# EasyEDA Pro project ZHAO-Watch-music版_2025-03-24.epro

# Schematic Schematic1
Create Date: 2025-02-28; Page Name: P1; Project Name: ZHAO-Watch-music版; Schematic Name: Schematic1; Update Date: 2025-03-11; Company: 嘉立创EDA; Page Size: A4; Version: V1.0
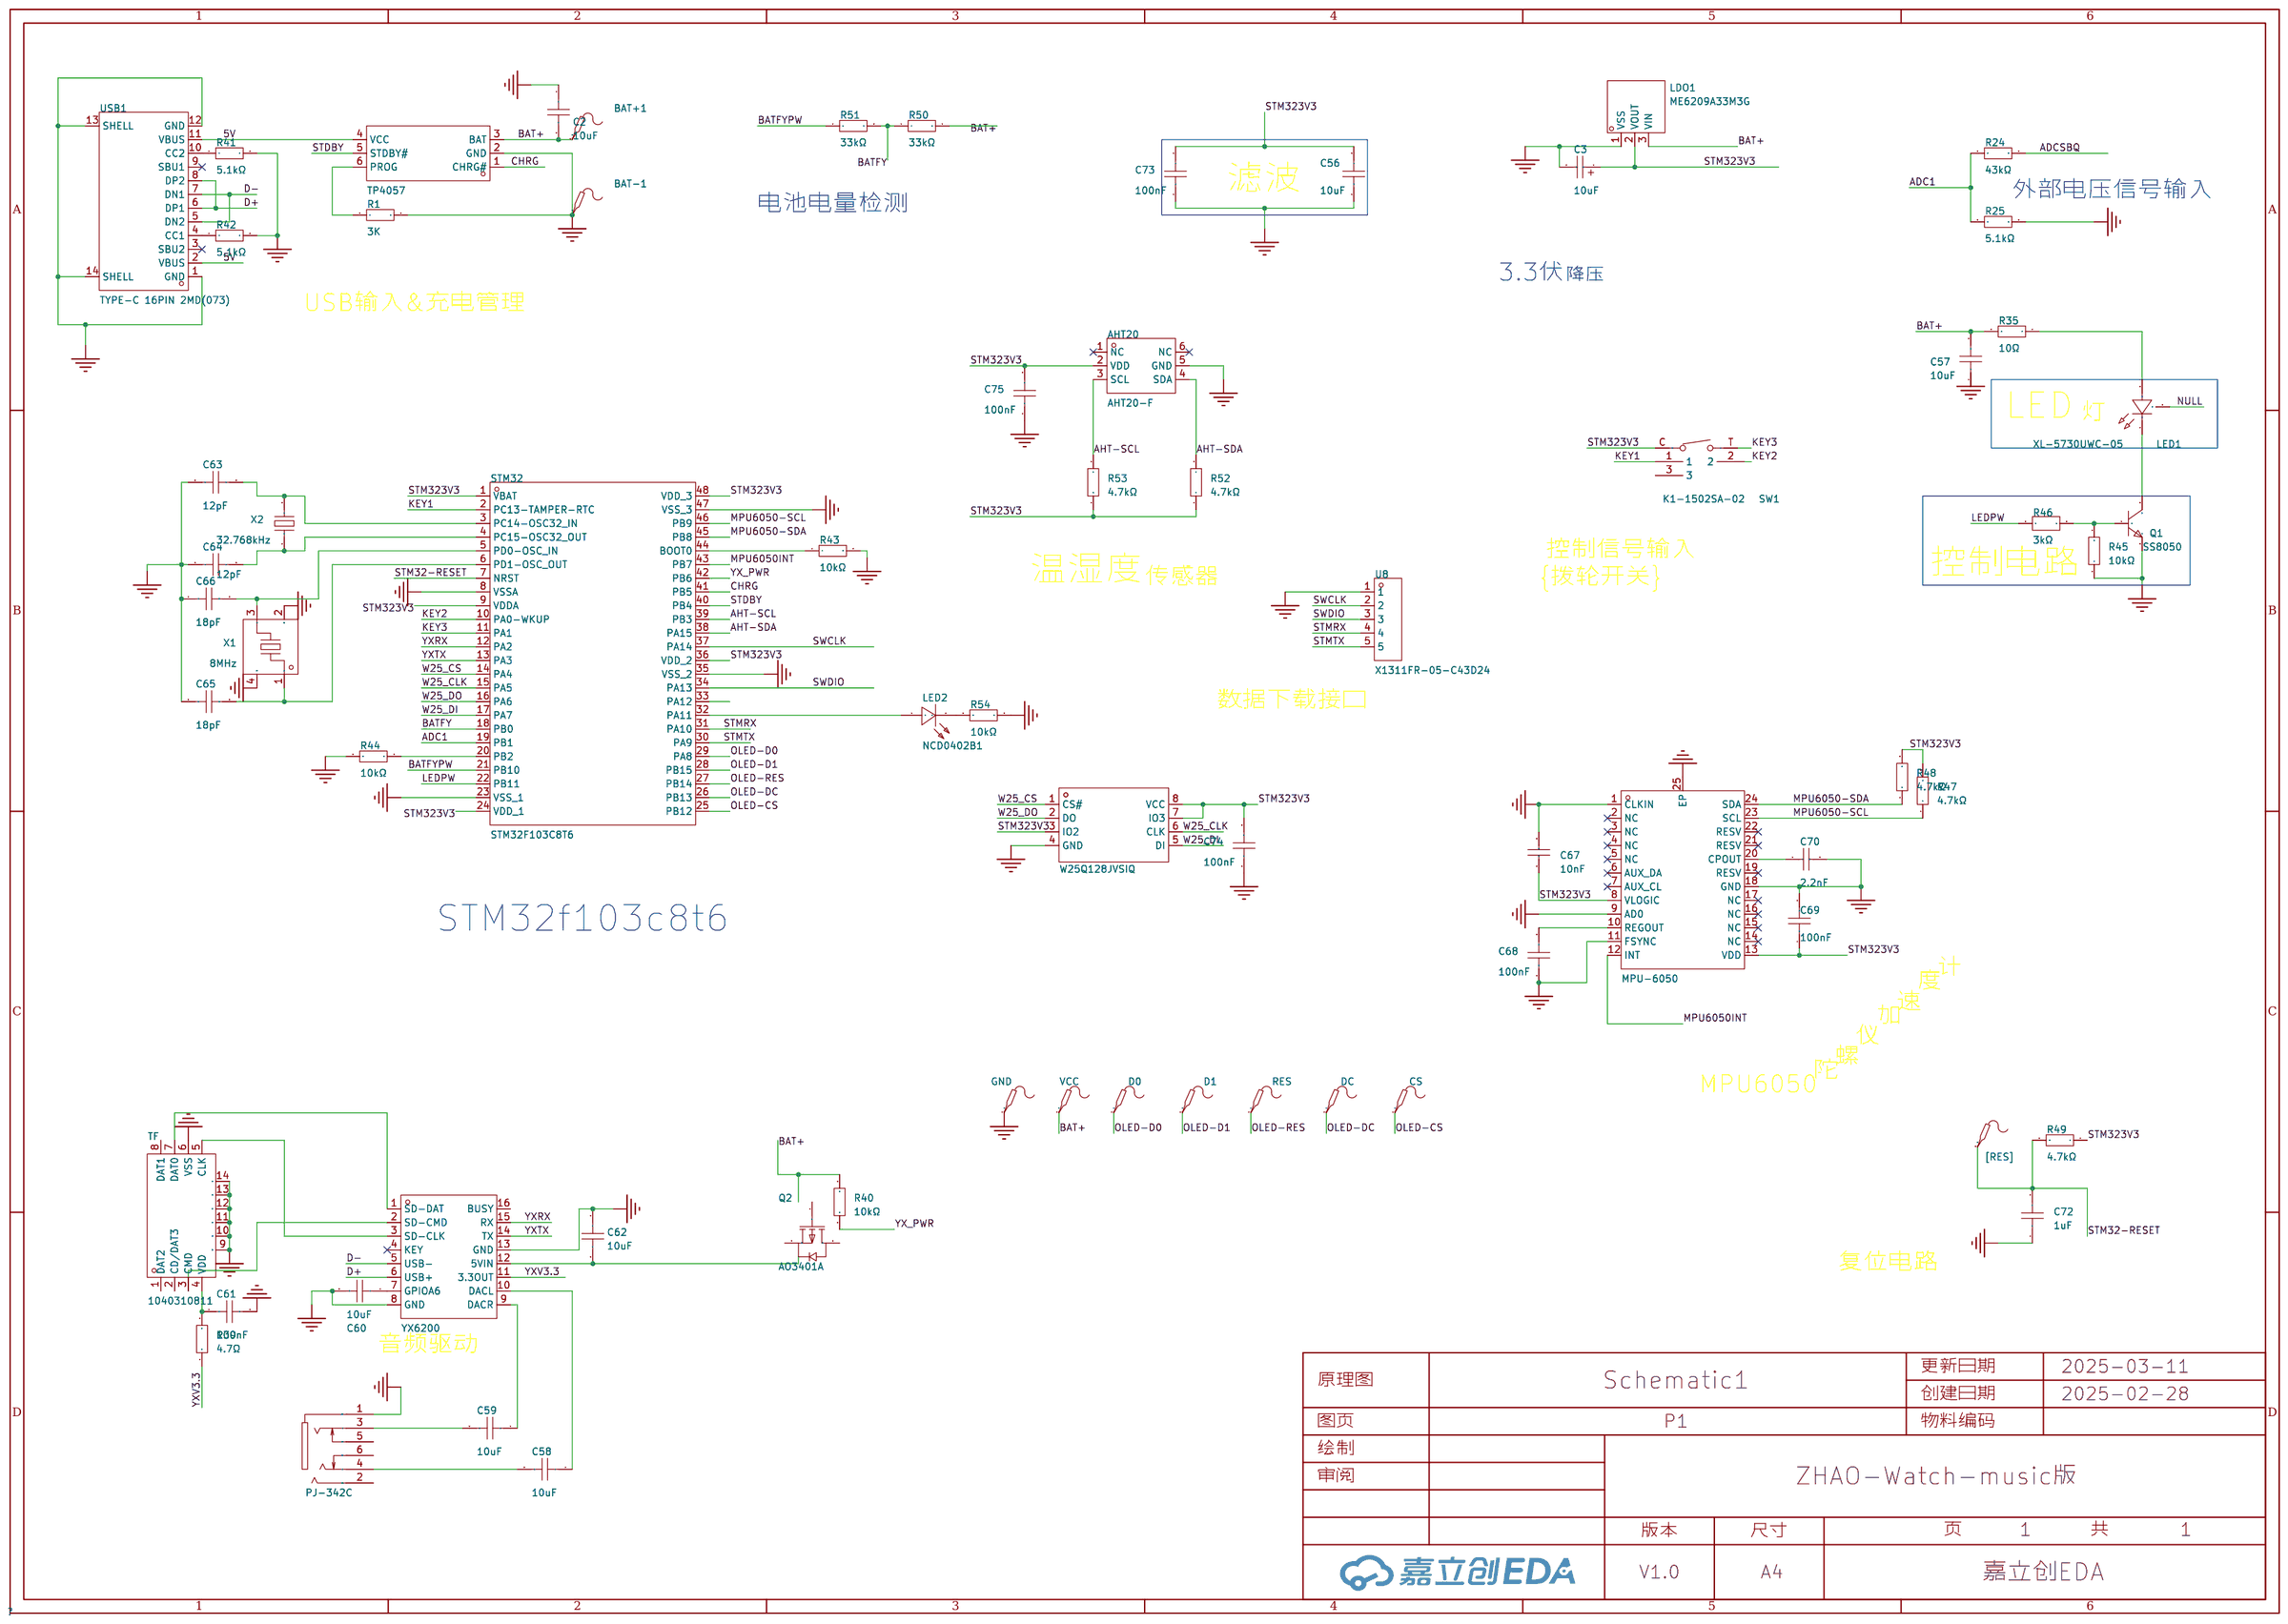
[diagram p0: schematic sheet]

## Parts
4057  TP4057  [SOT-23-6_L2.9-W1.6-P0.95-LS2.8-BR]
[RES]  -  [Test-Point-0.5mm]
AHT20  AHT20-F  [SENSOR-SMD-6_AHT20]
BAT+1  -  [Test-Point-0.5mm]
BAT-1  -  [Test-Point-0.5mm]
C2  10uF  [C0603]
C3  10uF  [CASE-A_3216]
C56  10uF  [C0603]
C57  10uF  [C0603]
C58  10uF  [C0603]
C59  10uF  [C0603]
C60  10uF  [C0603]
C61  100nF  [C0402]
C62  10uF  [C0603]
C63  12pF  [C0402]
C64  12pF  [C0402]
C65  18pF  [C0402]
C66  18pF  [C0402]
C67  10nF  [C0402]
C68  100nF  [C0402]
C69  100nF  [C0402]
C70  2.2nF  [C0402]
C72  1uF  [C0402]
C73  100nF  [C0402]
C74  100nF  [C0402]
C75  100nF  [C0402]
CN1  PJ-342C  [AUDIO-SMD_PJ-342C]
CS  -  [Test-Point-0.5mm]
D0  -  [Test-Point-0.5mm]
D1  -  [Test-Point-0.5mm]
DC  -  [Test-Point-0.5mm]
GND  -  [Test-Point-0.5mm]
LDO1  ME6209A33M3G  [SOT-23-3_L2.9-W1.6-P1.90-LS2.8-BR]
LED1  XL-5730UWC-05  [LED-SMD_3P-L5.7-W3.0-RD]
LED2  NCD0402B1  [LED0402-R-RD]
MPU-6050  MPU-6050  [QFN-24_L4.0-W4.0-P0.50-BL-EP2.7]
Q1  SS8050  [SOT-23-3_L2.9-W1.3-P1.90-LS2.4-BR]
Q2  AO3401A  [SOT-23_L2.9-W1.3-P1.90-LS2.4-BR]
R1  3K  [R0603]
R24  43kΩ  [R0603]
R25  5.1kΩ  [R0603]
R35  10Ω  [R0603]
R39  4.7Ω  [R0402]
R40  10kΩ  [R0402]
R41  5.1kΩ  [R0402]
R42  5.1kΩ  [R0402]
R43  10kΩ  [R0402]
R44  10kΩ  [R0402]
R45  10kΩ  [R0402]
R46  3kΩ  [R0402]
R47  4.7kΩ  [R0402]
R48  4.7kΩ  [R0402]
R49  4.7kΩ  [R0402]
R50  33kΩ  [R0402]
R51  33kΩ  [R0402]
R52  4.7kΩ  [R0402]
R53  4.7kΩ  [R0402]
R54  10kΩ  [R0402]
RES  -  [Test-Point-0.5mm]
STM32  STM32F103C8T6  [LQFP-48_L7.0-W7.0-P0.50-LS9.0-BL]
SW1  K1-1502SA-02  [KEY-SMD_K1-1502SA-02]
TF  1040310811  [SIM-SMD_8P-1040310811]
U8  X1311FR-05-C43D24  [CONN-TH_5P-P1.27-H-F-W4.5-N]
USB1  TYPE-C 16PIN 2MD(073)  [USB-C-SMD_TYPE-C-6PIN-2MD-073]
VCC  -  [Test-Point-0.5mm]
W25Q128  W25Q128JVSIQ  [SOIC-8_L5.3-W5.3-P1.27-LS8.0-BL]
X1  8MHz  [CRYSTAL-SMD_4P-L3.2-W2.5-BL]
X2  32.768kHz  [OSC-SMD_L3.2-W1.5]
YX6200  YX6200  [SOP-16_L9.9-W3.9-P1.27-LS6.0-BL]

## Library data of the parts
4057 = TP4057: 电源电压:6.5V;最大充电电流:500mA;电池类型:锂离子/聚合物;电池节数:1;; Supplier Part: C725791; Manufacturer: UMW(友台半导体); Supplier Footprint: SOT-23-6; JLCPCB Part Class: 扩展库; Datasheet: https://atta.szlcsc.com/upload/public/pdf/source/20231109/7FB39B0490CD1514A6792371FCA0BB30.pdf; Supplier: LCSC; Supply Voltage: 6.5V; Maximum Charge Current: 500mA; Type of Battery: 锂离子/聚合物; Number of Cells: 1; Operating Temperature: -40℃~+85℃
[RES] BAT+1 BAT-1 CS D0 D1 DC GND RES VCC = Test-Point: Test Point 测试点
AHT20 = AHT20-F: LCSC Part Name: 温湿度传感器; Supplier Part: C3012622; Manufacturer: 广州奥松; Supplier Footprint: SMD-6P,3x3mm; JLCPCB Part Class: 扩展库; Datasheet: https://atta.szlcsc.com/upload/public/pdf/source/20220512/0D1202ED7D1FEF1E65C45BAEA3A262F3.pdf; Supplier: LCSC
C2 = CL10A106MQ8NNNC: 容值:10uF;精度:±20%;额定电压:6.3V;材质(温度系数):X5R;; LCSC Part Name: 10uF ±20% 6.3V; Supplier Part: C1691; Manufacturer: SAMSUNG(三星); Supplier Footprint: 0603; JLCPCB Part Class: 扩展库; Datasheet: https://atta.szlcsc.com/upload/public/pdf/source/20160218/1457707763339.pdf; Supplier: LCSC; Tolerance: ±20%; Voltage Rated: 6.3V; Temperature Coefficient: X5R
C3 = TAJA106K010RNJ: 容值:10uF;精度:±10%;额定电压:10V;等效串联电阻:3Ω@100kHz;; LCSC Part Name: 10uF ±10% 10V; Supplier Part: C7177; Manufacturer: Kyocera AVX; Supplier Footprint: CASE-A-3216; JLCPCB Part Class: 扩展库; Datasheet: https://atta.szlcsc.com/upload/public/pdf/source/20160107/1457707750344.pdf; Supplier: LCSC; Tolerance: ±10%; Rated Voltage: 10V; Equivalent Series Resistance(ESR): 3Ω@100kHz; Operating Temperature: -55℃~+125℃
C56-C60 C62 = CAP_0603: Supplier Footprint: 0603
C61 C68 C69 C73-C75 = GRM155R71H104KE14D: 容值:100nF;精度:±10%;额定电压:50V;材质(温度系数):X7R;; LCSC Part Name: 100nF ±10% 50V; Supplier Part: C77020; Manufacturer: muRata(村田); Supplier Footprint: 0402; JLCPCB Part Class: 扩展库; Datasheet: https://atta.szlcsc.com/upload/public/pdf/source/20180326/C77020_39BD49C951FF1AF0DB1F1FAC5AC1E401.pdf; Supplier: LCSC; Tolerance: ±10%; Voltage Rated: 50V; Temperature Coefficient: X7R
C63 C64 = GCM1555C1H120FA16D: 容值:12pF;精度:±1%;额定电压:50V;材质(温度系数):C0G;; LCSC Part Name: 12pF ±1% 50V; Supplier Part: C393682; Manufacturer: muRata(村田); Supplier Footprint: 0402; JLCPCB Part Class: 扩展库; Datasheet: https://atta.szlcsc.com/upload/public/pdf/source/20190516/C393682_2405B7553F1D74F0F214F12B2CF6E34B.pdf; Supplier: LCSC; Tolerance: ±1%; Voltage Rated: 50V; Temperature Coefficient: C0G
C65 C66 = GRM1555C1H180JA01D: 容值:18pF;精度:±5%;额定电压:50V;材质(温度系数):C0G;; LCSC Part Name: 18pF ±5% 50V; Supplier Part: C33149; Manufacturer: muRata(村田); Supplier Footprint: 0402; JLCPCB Part Class: 扩展库; Datasheet: https://atta.szlcsc.com/upload/public/pdf/source/20161108/1478586362936.pdf; Supplier: LCSC; Tolerance: ±5%; Voltage Rated: 50V; Temperature Coefficient: C0G
C67 = CC0402KRX7R9BB103: 容值:10nF;精度:±10%;额定电压:50V;材质(温度系数):X7R;; LCSC Part Name: 10nF ±10% 50V; Supplier Part: C60133; Manufacturer: YAGEO(国巨); Supplier Footprint: 0402; JLCPCB Part Class: 扩展库; Datasheet: https://atta.szlcsc.com/upload/public/pdf/source/20180224/C181747_15194369449651363981.pdf; Supplier: LCSC; Tolerance: ±10%; Voltage Rated: 50V; Temperature Coefficient: X7R
C70 = GCM155R71H222KA37D: 容值:2.2nF;精度:±10%;额定电压:50V;材质(温度系数):X7R;; LCSC Part Name: 2.2nF ±10% 50V; Supplier Part: C126534; Manufacturer: muRata(村田); Supplier Footprint: 0402; JLCPCB Part Class: 扩展库; Datasheet: https://atta.szlcsc.com/upload/public/pdf/source/20170912/C126534_1505207904789963631.pdf; Supplier: LCSC; Tolerance: ±10%; Voltage Rated: 50V; Temperature Coefficient: X7R
C72 = CL05A105KA5NQNC: 容值:1uF;精度:±10%;额定电压:25V;材质(温度系数):X5R;; LCSC Part Name: 1uF ±10% 25V; Supplier Part: C52923; Manufacturer: SAMSUNG(三星); Supplier Footprint: 0402; JLCPCB Part Class: 基础库; Datasheet: https://atta.szlcsc.com/upload/public/pdf/source/20160218/1457707763339.pdf; Supplier: LCSC; Tolerance: ±10%; Voltage Rated: 25V; Temperature Coefficient: X5R
CN1 = PJ-342C_C2837091: 连接器类型:3.5mm耳机座;额定电流:1A;额定电压:20V;触头材质:磷铜;触头镀层:金;工作温度范围:-20℃~+70℃;; LCSC Part Name: 3.5mm耳机座; Supplier Part: C2837091; Manufacturer: G-Switch(品赞); Supplier Footprint: SMD; JLCPCB Part Class: 扩展库; Datasheet: https://atta.szlcsc.com/upload/public/pdf/source/20210607/C2837091_86A1520FDAE2EB54456CB4C4293AF32B.pdf; Supplier: LCSC; Connector Type: 3.5mm耳机座; Current Rating (Max): 1A; Voltage Rating (Max): 20V; Contact Material: 磷铜; Contact Plating: 金; Operating Temperature Range: -20℃~+70℃
LDO1 = ME6209A33M3G: 输出类型:固定;最大输入电压:18V;输出电压:3.3V;最大输出电流:250mA;电源纹波抑制比(PSRR):-;输出极性:正极;; LCSC Part Name: 输入18V 输出3.3V 250mA; Supplier Part: C83508; Manufacturer: MICRONE(南京微盟); Supplier Footprint: SOT-23-3L; JLCPCB Part Class: 扩展库; Datasheet: https://atta.szlcsc.com/upload/public/pdf/source/20161212/1481539101152.pdf; Supplier: LCSC; Output Type: 固定; Maximum Input Voltage: 18V; Output Voltage: 3.3V; MAX Output Current: 250mA; Dropout Voltage: 80mV@(40mA); Output Polarity: 正极; Number of Outputs: 1
LED1 = XL-5730UWC-05: 发光颜色:白色;功率:500mW;正向电流:150mA;透镜颜色:黄色透镜;色温:6000K~6500K;发光角度:120°;载带方式:正贴;工作温度:-30℃~+85℃;; Supplier Part: C2843887; Manufacturer: XINGLIGHT(成兴光); Supplier Footprint: SMD5730; JLCPCB Part Class: 扩展库; Datasheet: https://atta.szlcsc.com/upload/public/pdf/source/20221102/E8767F8417912EAAA1891B3E1CB1CE9F.pdf; Supplier: LCSC; Emitted Color: 白色; Power Dissipation: 500mW; Forward Current: 150mA; Lens Color: 黄色透镜; Color Temperature: 6000K~6500K; Viewing Angle: 120°; Mounting Sytle: 正贴; Operating Temperature: -30℃~+85℃
LED2 = NCD0402B1: 发光颜色:蓝色;正向电压(VF):2.6V~3.6V;功率:72mW;正向电流:5mA;主波长:463nm~475nm;透镜颜色:无色透明透镜;发光强度:16mcd~45mcd;发光角度:130°;工作温度:-30℃~+85℃;; Supplier Part: C130724; Manufacturer: 国星光电; Supplier Footprint: 0402; JLCPCB Part Class: 扩展库; Datasheet: https://atta.szlcsc.com/upload/public/pdf/source/20200820/C130724_4F54C0E9D8DAD44D7011DC9EC6DBEF20.pdf; Supplier: LCSC; Emitted Color: 蓝色; Forward Voltage (VF): 2.6V~3.6V; Power Dissipation: 72mW; Forward Current: 5mA; Dominant Wavelength: 463nm~475nm; Lens Color: 无色透明透镜; Luminous Intensity: 16mcd~45mcd; Viewing Angle: 130°; Operating Temperature: -30℃~+85℃
MPU-6050 = MPU-6050: 传感器类型:加速度计陀螺仪;; Supplier Part: C24112; Manufacturer: TDK InvenSense(应美盛); Supplier Footprint: QFN-24-EP(4x4); JLCPCB Part Class: 扩展库; Datasheet: https://atta.szlcsc.com/upload/public/pdf/source/20140425/1457707046159.pdf; Supplier: LCSC; Sensor Type: 加速度计陀螺仪; Operating Temperature: -40℃~+85℃
Q1 = SS8050_C7420370: 晶体管类型:NPN;集电极电流(Ic):1.5A;集射极击穿电压(Vceo):25V;功率(Pd):300mW;直流电流增益(hFE@Ic,Vce):120@100mA,1.0V;; LCSC Part Name: 耐压:25V 电流:1.5A NPN H档 200-350; Supplier Part: C7420370; Manufacturer: 宏迦橙; Supplier Footprint: SOT-23; JLCPCB Part Class: 扩展库; Datasheet: https://atta.szlcsc.com/upload/public/pdf/source/20231222/9C4050A7669EB24B3ACD0418218817FD.pdf; Supplier: LCSC; Transistor Type: NPN; Collector Current (Ic): 1.5A; Collector-Emitter Breakdown Voltage (Vceo): 25V; Power Dissipation (Pd): 300mW; DC Current Gain (hFE@Ic,Vce): 120@100mA,1.0V; Transition Frequency (fT): 100MHz; Collector Cut-Off Current (Icbo): 100nA; Collector-Emitter Saturation Voltage (VCE(sat)@Ic,Ib): 500mV@800mA,80mA; Operating Temperature: -55℃~+150℃
Q2 = AO3401A_C15127: 类型:1个P沟道;漏源电压(Vdss):30V;连续漏极电流(Id):4A;导通电阻(RDS(on)@Vgs,Id):44mΩ@10V,4.3A;功率(Pd):1.4W;阈值电压(Vgs(th)@Id):1.3V@250uA;; LCSC Part Name: 1个P沟道 耐压:30V 电流:4A; Supplier Part: C15127; Manufacturer: AOS; Supplier Footprint: SOT-23; JLCPCB Part Class: 基础库; Datasheet: https://atta.szlcsc.com/upload/public/pdf/source/20160507/1462613609053.pdf; Supplier: LCSC; Type: 1个P沟道; Drain Source Voltage (Vdss): 30V; Continuous Drain Current (Id): 4A; Drain Source On Resistance (RDS(on)@Vgs,Id): 44mΩ@10V,4.3A; Power Dissipation (Pd): 1.4W; Gate Threshold Voltage (Vgs(th)@Id): 1.3V@250uA; Total Gate Charge (Qg@Vgs): 12.2nC@4.5V; Input Capacitance (Ciss@Vds): 1.2nF@15V; Operating Temperature: -55℃~+150℃@(Tj)
R1 = Res_0603: Supplier Footprint: 0603
R24 = 0603WAF1002T5E: 电阻类型:厚膜电阻;阻值:10kΩ;精度:±1%;功率:100mW;最大工作电压:75V;温度系数:±100ppm/℃;; LCSC Part Name: 厚膜电阻 10kΩ ±1% 100mW; Supplier Part: C25804; Manufacturer: UNI-ROYAL(厚声); Supplier Footprint: 0603; JLCPCB Part Class: 基础库; Datasheet: https://atta.szlcsc.com/upload/public/pdf/source/20200306/C422600_1E6D84923E4A46A82E41ADD87F860B5C.pdf; Supplier: LCSC; Type: 厚膜电阻; Tolerance: ±1%; Power(Watts): 100mW; Overload Voltage (Max): 75V; Temperature Coefficient: ±100ppm/℃; Operating Temperature Range: -55℃~+155℃
R25 = 0603WAF1801T5E: 电阻类型:厚膜电阻;阻值:1.8kΩ;精度:±1%;功率:100mW;最大工作电压:75V;温度系数:±100ppm/℃;; LCSC Part Name: 1.8kΩ ±1% 100mW 厚膜电阻; Supplier Part: C4177; Manufacturer: UNI-ROYAL(厚声); Supplier Footprint: 0603; JLCPCB Part Class: 基础库; Datasheet: https://atta.szlcsc.com/upload/public/pdf/source/20200306/C422600_1E6D84923E4A46A82E41ADD87F860B5C.pdf; Supplier: LCSC; Type: 厚膜电阻; Tolerance: ±1%; Power(Watts): 100mW; Overload Voltage (Max): 75V; Temperature Coefficient: ±100ppm/℃; Operating Temperature Range: -55℃~+155℃
R35 = 0603WAF100JT5E: 电阻类型:厚膜电阻;阻值:10Ω;精度:±1%;功率:100mW;最大工作电压:75V;温度系数:±400ppm/℃;; LCSC Part Name: 10Ω ±1% 100mW 厚膜电阻; Supplier Part: C22859; Manufacturer: UNI-ROYAL(厚声); Supplier Footprint: 0603; JLCPCB Part Class: 基础库; Datasheet: https://atta.szlcsc.com/upload/public/pdf/source/20200306/C422600_1E6D84923E4A46A82E41ADD87F860B5C.pdf; Supplier: LCSC; Type: 厚膜电阻; Tolerance: ±1%; Power(Watts): 100mW; Overload Voltage (Max): 75V; Temperature Coefficient: ±400ppm/℃; Operating Temperature Range: -55℃~+155℃
R39 = RC0402FR-074R7L: 电阻类型:厚膜电阻;阻值:4.7Ω;精度:±1%;功率:62.5mW;最大工作电压:50V;温度系数:±200ppm/℃;; LCSC Part Name: 厚膜电阻 4.7Ω ±1% 62.5mW; Supplier Part: C137962; Manufacturer: YAGEO(国巨); Supplier Footprint: 0402; JLCPCB Part Class: 扩展库; Datasheet: https://atta.szlcsc.com/upload/public/pdf/source/20181009/C309620_DA5935B6E1D48212CB7A533FE518B3C2.pdf; Supplier: LCSC; Type: 厚膜电阻; Tolerance: ±1%; Power(Watts): 62.5mW; Overload Voltage (Max): 50V; Temperature Coefficient: ±200ppm/℃; Operating Temperature Range: -55℃~+155℃
R40 R43-R45 R54 = 0402WGF1002TCE: 电阻类型:厚膜电阻;阻值:10kΩ;精度:±1%;功率:62.5mW;最大工作电压:50V;温度系数:±100ppm/℃;; LCSC Part Name: 10kΩ ±1% 62.5mW 厚膜电阻; Supplier Part: C25744; Manufacturer: UNI-ROYAL(厚声); Supplier Footprint: 0402; JLCPCB Part Class: 基础库; Datasheet: https://atta.szlcsc.com/upload/public/pdf/source/20200306/C422600_1E6D84923E4A46A82E41ADD87F860B5C.pdf; Supplier: LCSC; Type: 厚膜电阻; Tolerance: ±1%; Power(Watts): 62.5mW; Overload Voltage (Max): 50V; Temperature Coefficient: ±100ppm/℃; Operating Temperature Range: -55℃~+155℃
R41 R42 = 0402WGF5101TCE: 电阻类型:厚膜电阻;阻值:5.1kΩ;精度:±1%;功率:62.5mW;最大工作电压:50V;温度系数:±100ppm/℃;; LCSC Part Name: 5.1kΩ ±1% 62.5mW 厚膜电阻; Supplier Part: C25905; Manufacturer: UNI-ROYAL(厚声); Supplier Footprint: 0402; JLCPCB Part Class: 基础库; Datasheet: https://atta.szlcsc.com/upload/public/pdf/source/20200306/C422600_1E6D84923E4A46A82E41ADD87F860B5C.pdf; Supplier: LCSC; Type: 厚膜电阻; Tolerance: ±1%; Power(Watts): 62.5mW; Overload Voltage (Max): 50V; Temperature Coefficient: ±100ppm/℃; Operating Temperature Range: -55℃~+155℃
R46 = FRC0402F3001TS: 电阻类型:厚膜电阻;阻值:3kΩ;精度:±1%;功率:62.5mW;最大工作电压:50V;温度系数:±100ppm/℃;; LCSC Part Name: 3kΩ ±1% 62.5mW 厚膜电阻; Supplier Part: C2909355; Manufacturer: FOJAN(富捷); Supplier Footprint: 0402; JLCPCB Part Class: 扩展库; Datasheet: https://atta.szlcsc.com/upload/public/pdf/source/20211221/925EC7D7225764EE0046F22065062C87.pdf; Supplier: LCSC; Type: 厚膜电阻; Tolerance: ±1%; Power(Watts): 62.5mW; Overload Voltage (Max): 50V; Temperature Coefficient: ±100ppm/℃; Operating Temperature Range: -55℃~+155℃
R47-R49 R52 R53 = 0402WGF4701TCE: 电阻类型:厚膜电阻;阻值:4.7kΩ;精度:±1%;功率:62.5mW;最大工作电压:50V;温度系数:±100ppm/℃;; LCSC Part Name: 4.7kΩ ±1% 62.5mW 厚膜电阻; Supplier Part: C25900; Manufacturer: UNI-ROYAL(厚声); Supplier Footprint: 0402; JLCPCB Part Class: 基础库; Datasheet: https://atta.szlcsc.com/upload/public/pdf/source/20200306/C422600_1E6D84923E4A46A82E41ADD87F860B5C.pdf; Supplier: LCSC; Type: 厚膜电阻; Tolerance: ±1%; Power(Watts): 62.5mW; Overload Voltage (Max): 50V; Temperature Coefficient: ±100ppm/℃; Operating Temperature Range: -55℃~+155℃
R50 R51 = 0402WGF3302TCE: 电阻类型:厚膜电阻;阻值:33kΩ;精度:±1%;功率:62.5mW;最大工作电压:50V;温度系数:±100ppm/℃;; LCSC Part Name: 33kΩ ±1% 62.5mW 厚膜电阻; Supplier Part: C25779; Manufacturer: UNI-ROYAL(厚声); Supplier Footprint: 0402; JLCPCB Part Class: 基础库; Datasheet: https://atta.szlcsc.com/upload/public/pdf/source/20200306/C422600_1E6D84923E4A46A82E41ADD87F860B5C.pdf; Supplier: LCSC; Type: 厚膜电阻; Tolerance: ±1%; Power(Watts): 62.5mW; Overload Voltage (Max): 50V; Temperature Coefficient: ±100ppm/℃; Operating Temperature Range: -55℃~+155℃
STM32 = STM32F103C8T6: CPU内核:ARM-M3;程序存储容量:64KB;RAM总容量:20KB;GPIO端口数量:37;工作电压范围:2V~3.6V;CPU最大主频:72MHz;程序存储器类型:FLASH;; Supplier Part: C8734; Manufacturer: ST(意法半导体); Supplier Footprint: LQFP-48(7x7); JLCPCB Part Class: 扩展库; Datasheet: https://atta.szlcsc.com/upload/public/pdf/source/20220812/8363ACEC51AD55ECEB84799464F7CB85.pdf; Supplier: LCSC; CPU Core: ARM-M3; Program Storage Size: 64KB; RAM Size: 20KB; GPIO Ports Number: 37; Operating Voltage Range: 2V~3.6V; CPU Maximum Speed: 72MHz; Program Memory Type: FLASH; Operating Temperature Range: -40℃~+85℃; ADC (Bit): 12bit; Universal Serial Bus: 有; Peripheral/Function: 看门狗；DMA；看门狗；温度传感器; Watchdog: 有; Infrared Data Association: 有; Low-Voltage Detect: 有; Direct Memory Access: 有; Internal Oscillator: 有
SW1 = K1-1502SA-02: LCSC Part Name: 上中下按键三向拨轮开关 11.8mm*11.7mm; Supplier Part: C128929; Manufacturer: 韩国韩荣; Supplier Footprint: SMD-5P,11.7x11.8mm; JLCPCB Part Class: 扩展库; Datasheet: https://atta.szlcsc.com/upload/public/pdf/source/20210810/6E4D76E797EC1584D0EB8D60F77D41D6.pdf; Supplier: LCSC
TF = 1040310811: 卡连接方式:拔插式;卡类型:MicroSD卡(TF卡);连接器类型:卡座;本体最大高度:1.42mm;工作温度范围:-25℃~+85℃;; LCSC Part Name: 拔插式 MicroSD卡(TF卡) 卡座; Supplier Part: C585350; Manufacturer: MOLEX; Supplier Footprint: SMD; JLCPCB Part Class: 扩展库; Datasheet: https://www.molex.com/content/dam/molex/molex-dot-com/products/automated/en-us/salesdrawingpdf/104/104031/1040310811_sd.pdf?inline; Supplier: LCSC; Card Connection Mode: 拔插式; Card Type: MicroSD卡(TF卡); Connector Type: 卡座; Maximum Body Height: 1.42mm; Operating Temperature Range: -25℃~+85℃
U8 = X1311FR-05-C43D24: 插孔结构:1x5P;间距:1.27mm;行距:-;圆孔/方孔:方孔;安装类型:弯插;排数:单排;总孔位数:5P;额定电流:1A;额定电压:250V;插孔方向:侧面;塑高:4.3mm;触头材质:黄铜;触头镀层:金;工作温度范围:-40℃~+105℃;焊接温度(最大值):260℃;; LCSC Part Name: 间距:1.27mm 1x5P 弯插; Supplier Part: C2881476; Manufacturer: XKB Connectivity(中国星坤); Supplier Footprint: 弯插,P=1.27mm; JLCPCB Part Class: 扩展库; Datasheet: https://atta.szlcsc.com/upload/public/pdf/source/20211011/A24861EA633A2CD5B8EF341939930472.pdf; Supplier: LCSC; Holes Structure: 1x5P; Pitch: 1.27mm; Circular Hole / Square Hole: 方孔; Mounting Type: 弯插; Number of Rows: 单排; Number of Holes: 5P; Current Rating (Max): 1A; Voltage Rating (Max): 250V; Holes Direction: 侧面; Insulation Height: 4.3mm; Contact Material: 黄铜; Contact Plating: 金; Operating Temperature Range: -40℃~+105℃; Soldering Temperature(Max): 260℃
USB1 = TYPE-C 16PIN 2MD(073): 连接器类型:Type-C;标准:-;公母:母;端口数量:1;触点数量:16P;安装方式:卧贴;额定电流 - 电源:5A;工作温度范围:-25℃~+85℃;; LCSC Part Name: Type-C 母 卧贴; Supplier Part: C2765186; Manufacturer: SHOU HAN(首韩); Supplier Footprint: SMD; JLCPCB Part Class: 扩展库; Datasheet: https://atta.szlcsc.com/upload/public/pdf/source/20211123/39B17C16241EAC15C5E277BDA434118E.pdf; Supplier: LCSC; Connector Type: Type-C; Gender: 母; Number of Ports: 1; Number of Contacts: 16P; Mounting Style: 卧贴; Current Rating - Power (Max): 5A; Operating Temperature Range: -25℃~+85℃
W25Q128 = W25Q128JVSIQ: 接口类型:-;存储容量:128Mbit;时钟频率(fc):-;; LCSC Part Name: W25Q128JVSIQ 编带; Supplier Part: C97521; Manufacturer: WINBOND(华邦); Supplier Footprint: SOIC-8-208mil; JLCPCB Part Class: 基础库; Datasheet: https://atta.szlcsc.com/upload/public/pdf/source/20170316/1489627409956.pdf; Supplier: LCSC; Memory Size: 128Mbit
X1 = X32258MSB4SI: 晶振类型:贴片晶振;频率:8MHz;常温频差:±10ppm;外接负载电容:20pF;频率稳定度(全温):±20ppm;; LCSC Part Name: 8MHz ±10ppm 20pF; Supplier Part: C2682774; Manufacturer: YXC(扬兴晶振); Supplier Footprint: SMD3225-4P; JLCPCB Part Class: 扩展库; Datasheet: https://atta.szlcsc.com/upload/public/pdf/source/20240329/19D5F850207469550BEB00D7DFEDBC7A.pdf; Supplier: LCSC; Crystal Type: 贴片晶振; Normal temperature Frequency Tolerance: ±10ppm; External load capacitor: 20pF; Frequency Stability(Full temperature range): ±20ppm; Operating Temperature: -40℃~+85℃
X2 = X321532768KGD2SI: 晶振类型:贴片晶振;频率:32.768kHz;常温频差:±20ppm;外接负载电容:12.5pF;频率稳定度(全温):-;; LCSC Part Name: 32.768kHz ±20ppm 12.5pF; Supplier Part: C620155; Manufacturer: YXC(扬兴晶振); Supplier Footprint: SMD3215-2P; JLCPCB Part Class: 扩展库; Datasheet: https://atta.szlcsc.com/upload/public/pdf/source/20240329/3A7650FD985DD0DE85694D3785AB4916.pdf; Supplier: LCSC; Crystal Type: 贴片晶振; Normal temperature Frequency Tolerance: ±20ppm; External load capacitor: 12.5pF; Operating Temperature: -40℃~+85℃
YX6200 = YX6200: Supplier Footprint: SOP-16

## Nets
5V: 4057.4(VCC) USB1.2(VBUS) USB1.11(VBUS)
GND: 4057.2(GND) AHT20.5(GND) BAT-1.1 C2.1 C3.2 C56.1 C57.1 C60.2 C61.2 C62.1 C63.2 C64.2 C65.1 C66.1 C67.2 C68.1 C69.2 C70.2 C72.1 C73.1 C74.1 C75.1 CN1.1(GND(MIC)) GND.1 LDO1.1(VSS) MPU-6050.1(CLKIN) MPU-6050.9(AD0) MPU-6050.11(FSYNC) MPU-6050.18(GND) MPU-6050.25(EP) Q1.2(E) R1.2 R25.2 R41.2 R42.2 R43.2 R44.1 R45.1 R54.2 STM32.8(VSSA) STM32.23(VSS_1) STM32.35(VSS_2) STM32.47(VSS_3) TF.6(VSS) TF.9 TF.10 TF.11 TF.12 TF.13 TF.14 U8.1 USB1.1(GND) USB1.12(GND) USB1.13(SHELL) USB1.14(SHELL) W25Q128.4(GND) X1.2(GND) X1.4(GND) YX6200.8(GND) YX6200.13(GND)
ADC1: R24.1 R25.1 STM32.19(PB1)
ADCSBQ: R24.2
AHT-SCL: AHT20.3(SCL) R53.2 STM32.39(PB3)
AHT-SDA: AHT20.4(SDA) R52.2 STM32.38(PA15)
BAT+: 4057.3(BAT) BAT+1.1 C2.2 C57.2 LDO1.3(VIN) Q2.2(S) R35.2 R40.2 R50.2 VCC.1
BATFY: R50.1 R51.2 STM32.18(PB0)
BATFYPW: R51.1 STM32.21(PB10)
CHRG: 4057.1(CHRG#) STM32.41(PB5)
D+: USB1.6(DP1) USB1.8(DP2) YX6200.6(USB+)
D-: USB1.5(DN2) USB1.7(DN1) YX6200.5(USB-)
KEY1: STM32.2(PC13-TAMPER-RTC) SW1.1
KEY2: STM32.10(PA0-WKUP) SW1.2
KEY3: STM32.11(PA1) SW1.T
LEDPW: R46.1 STM32.22(PB11)
MPU6050-SCL: MPU-6050.23(SCL) R47.1 STM32.46(PB9)
MPU6050-SDA: MPU-6050.24(SDA) R48.1 STM32.45(PB8)
MPU6050INT: MPU-6050.12(INT) STM32.43(PB7)
NULL: LED1.3
OLED-CS: CS.1 STM32.25(PB12)
OLED-D0: D0.1 STM32.29(PA8)
OLED-D1: D1.1 STM32.28(PB15)
OLED-DC: DC.1 STM32.26(PB13)
OLED-RES: RES.1 STM32.27(PB14)
STDBY: 4057.5(STDBY#) STM32.40(PB4)
STM32-RESET: [RES].1 C72.2 R49.2 STM32.7(NRST)
STM323V3: AHT20.2(VDD) C3.1 C56.2 C67.1 C69.1 C73.2 C74.2 C75.2 LDO1.2(VOUT) MPU-6050.8(VLOGIC) MPU-6050.13(VDD) R47.2 R48.2 R49.1 R52.1 R53.1 STM32.1(VBAT) STM32.9(VDDA) STM32.24(VDD_1) STM32.36(VDD_2) STM32.48(VDD_3) SW1.C W25Q128.3(IO2) W25Q128.7(IO3) W25Q128.8(VCC)
STMRX: STM32.31(PA10) U8.4
STMTX: STM32.30(PA9) U8.5
SWCLK: STM32.37(PA14) U8.2
SWDIO: STM32.34(PA13) U8.3
W25_CLK: STM32.15(PA5) W25Q128.6(CLK)
W25_CS: STM32.14(PA4) W25Q128.1(CS#)
W25_DI: STM32.17(PA7) W25Q128.5(DI)
W25_DO: STM32.16(PA6) W25Q128.2(DO)
YX_PWR: Q2.1(G) R40.1 STM32.42(PB6)
YXRX: STM32.12(PA2) YX6200.15(RX)
YXTX: STM32.13(PA3) YX6200.14(TX)
YXV3.3: R39.1 YX6200.11(3.3OUT)
$1N3494: 4057.6(PROG) R1.1
$1N4397: LED1.1(K) Q1.3(C)
$1N4399: LED1.2(A) R35.1
$1N4402: Q1.1(B) R45.2 R46.2
$1N5156: C63.1 STM32.3(PC14-OSC32_IN) X2.2
$1N5157: C64.1 STM32.4(PC15-OSC32_OUT) X2.1
$1N5158: C66.2 STM32.5(PD0-OSC_IN) X1.3
$1N5159: C65.2 STM32.6(PD1-OSC_OUT) X1.1
$1N5168: R43.1 STM32.44(BOOT0)
$1N5201: R44.2 STM32.20(PB2)
$1N5846: C70.1 MPU-6050.20(CPOUT)
$1N5858: C68.2 MPU-6050.10(REGOUT)
$1N10780: C58.1 YX6200.10(DACL)
$1N10809: C59.1 YX6200.9(DACR)
$1N10843: C59.2 CN1.3(RT)
$1N10898: C60.1 YX6200.7(GPIOA6)
$1N10910: TF.7(DAT0) YX6200.1(SD-DAT)
$1N10951: TF.5(CLK) YX6200.3(SD-CLK)
$1N11148: C61.1 R39.2 TF.4(VDD)
$1N11256: TF.3(CMD) YX6200.2(SD-CMD)
$1N11269: C62.2 Q2.3(D) YX6200.12(5VIN)
$1N11541: C58.2 CN1.4(LET)
$1N11648: R41.1 USB1.10(CC2)
$1N11687: R42.1 USB1.4(CC1)
$1N18711: LED2.1(A) STM32.32(PA11)
$1N18751: LED2.2(K) R54.1

Not connected (* = marked no-connect by the designer): AHT20 1(NC)* 6(NC)*; CN1 2(MIC(GND)) 5(DETECT) 6(DETECT); MPU-6050 2(NC)* 3(NC)* 4(NC)* 5(NC)* 6(AUX_DA)* 7(AUX_CL)* 14(NC)* 15(NC)* 16(NC)* 17(NC)* 19(RESV)* 21(RESV)* 22(RESV)*; STM32 33(PA12); SW1 3; TF 1(DAT2) 2(CD/DAT3) 8(DAT1); USB1 3(SBU2)* 9(SBU1)*; YX6200 4(KEY)* 16(BUSY)

## Notes on the sheet
- 滤波
- 外部电压信号输入
- 电池电量检测
- 3.3伏
- 降压
- USB输入&充电管理
- LED
- 灯
- 控制信号输入
- 控制电路
- 温湿度
- 传感器
- {拨轮开关}
- 数据下载接口
- STM32f103c8t6
- 计
- 度
- 速
- 加
- 仪
- 螺
- MPU6050
- 陀
- 复位电路
- 音频驱动

# Board PCB1
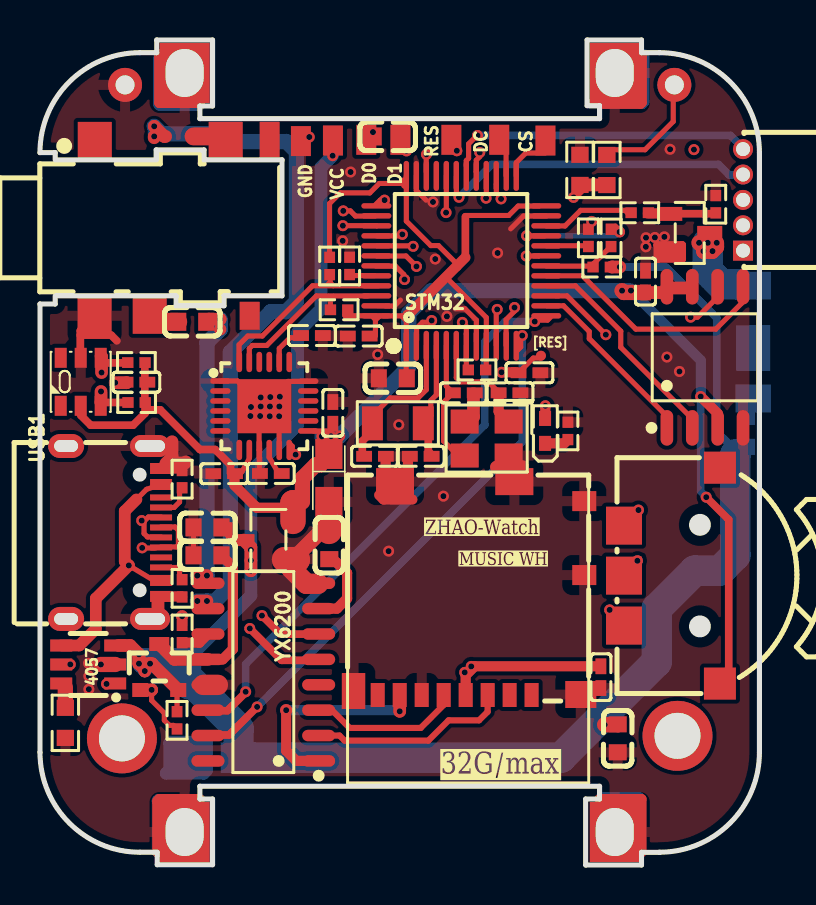
[diagram p1: board, top side]
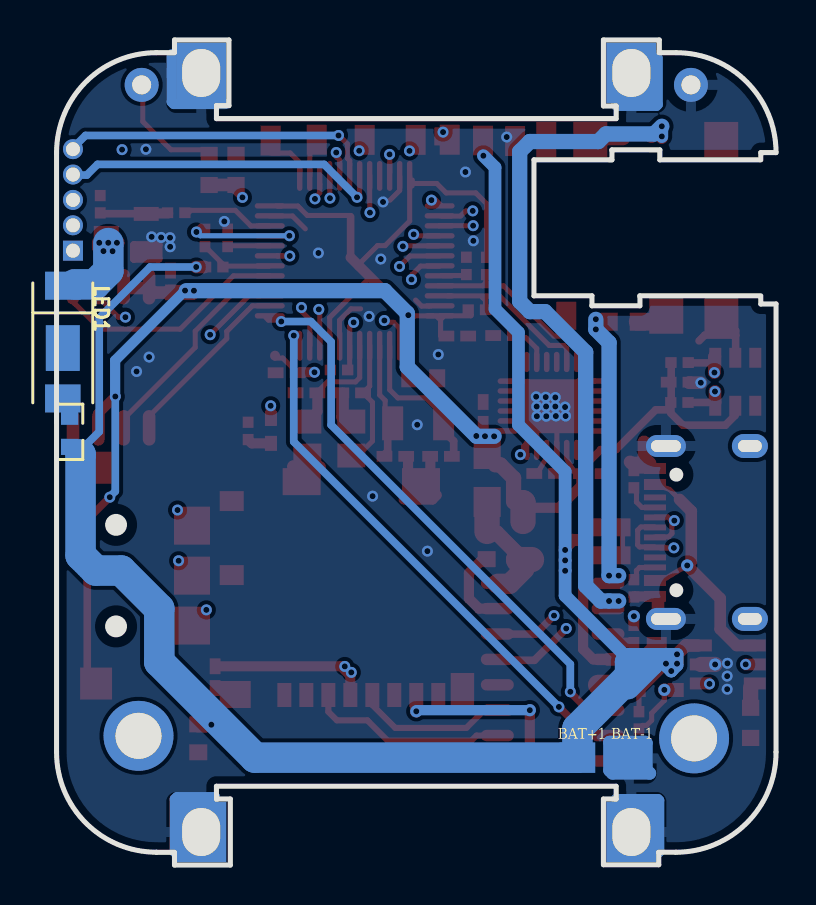
[diagram p2: board, bottom side, seen from below]

Outline 36 x 41.27 mm; copper layers: Top Layer, Inner1, Inner2, Bottom Layer. Coordinates in mm from the lower left corner of the outline.
Outline path: 0.76,35.28 0.76,35.64 0,35.64 arc(1.46,39.18) 5,40.64 5.84,40.64 5.84,41.27 8.64,41.27 8.64,37.97 8,37.97 8,37.34 28,37.34 28,37.99 27.38,37.99 27.38,41.27 30.1,41.27 30.1,40.64 31,40.64 arc(34.54,39.18) 36,35.64 36,5.64 arc(34.54,2.1) 31,0.64 31,0.63 30.1,0.63 30.1,0 27.31,0 27.31,3.3 28,3.3 28,3.94 8,3.94 8,3.3 8.64,3.3 8.64,0.01 5.87,0.01 5.87,0.64 5,0.64 arc(1.46,2.1) 0,5.64 0,28.07 0.76,28.07 0.76,28.48
Stack: Top Layer 0.035mm 外层铜厚1oz / Dielectric1 0.3467mm 7628 RC49% 8.6mil / Inner1 0.035mm 内层铜厚 / Dielectric2 0.3467mm 1.1mm H/HOZ 含铜 / Inner2 0.035mm 内层铜厚 / Dielectric3 0.3467mm 7628 RC49% 8.6mil / Bottom Layer 0.035mm 外层铜厚1oz

## Design rules (mm)
template: JLCPCB Capability(Two Layers Board)
spacing copperThickness1oz (default): track to track 0.102, other pairs 0.152 to 0.3
spacing copperThickness2oz: track to track 0.203, other pairs 0.152 to 0.3
track width copperThickness1oz (default): min 0.127, default 0.254, max 2.54
track width copperThickness2oz: min 0.203, default 0.254, max 2.54
differential pair differentialPair (default): width min 0.127, default 0.254, max 2.54; gap min 0.152, default 0.152
via viaSize (default): diameter min 0.5, default 0.61, max 10; hole min 0.3, default 0.305, max 6.3

## Placement (name value [footprint] x y rotation side)
4057  TP4057  [SOT-23-6_L2.9-W1.6-P0.95-LS2.8-BR]  2.41 10.03 0 top
[RES]  -  [Test-Point-0.5mm]  25.07 25.48 0 top
AHT20  AHT20-F  [SENSOR-SMD-6_AHT20]  2.04 24.17 90 top
BAT+1  -  [test-point-0.5mm#2]  9.94 5.37 180 bottom
BAT-1  -  [test-point-0.5mm#2]  7.37 5.33 180 bottom
C2  10uF  [C0603]  8.38 16.89 0 top
C3  10uF  [CASE-A_3216]  14.45 19.36 270 top
C56  10uF  [C0603]  17.65 24.35 0 top
C57  10uF  [C0603]  28.91 6.34 90 top
C58  10uF  [C0603]  17.4 36.45 0 top
C59  10uF  [C0603]  7.62 27.18 180 top
C60  10uF  [C0603]  14.48 16 90 top
C61  100nF  [C0402]  28.07 9.4 270 top
C62  10uF  [C0603]  8.38 15.49 0 top
C63  12pF  [C0402]  16.76 20.45 0 top
C64  12pF  [C0402]  19.05 20.45 180 top
C65  18pF  [C0402]  23.5 23.62 180 top
C66  18pF  [C0402]  21.21 23.62 180 top
C67  10nF  [C0402]  9.22 19.58 180 top
C68  100nF  [C0402]  11.55 19.59 0 top
C69  100nF  [C0402]  14.65 22.62 90 top
C70  2.2nF  [C0402]  13.61 26.49 0 top
C72  1uF  [C0402]  24.49 24.63 180 top
C73  100nF  [C0402]  15.95 26.46 0 top
C74  100nF  [C0402]  30.3 29.19 270 top
C75  100nF  [C0402]  4.83 24.16 0 top
CN1  PJ-342C  [audio-smd_pj-342c]  7.11 31.88 90 top
CS  -  [test-point-0.5mm]  25.29 36.24 0 top
D0  -  [test-point-0.5mm]  16.33 36.28 0 top
D1  -  [test-point-0.5mm]  18.03 36.28 0 top
DC  -  [test-point-0.5mm]  22.98 36.28 0 top
GND  -  [test-point-0.5mm]  13.06 36.22 0 top
LDO1  ME6209A33M3G  [SOT-23-3_L2.9-W1.6-P1.90-LS2.8-BR]  11.43 16.26 0 top
LED1  XL-5730UWC-05  [led-smd_3p-l5.7-w3.0-rd]  35.69 26.16 270 bottom
LED2  NCD0402B1  [LED0402-R-RD]  25.27 21.72 90 top
MPU-6050  MPU-6050  [qfn-24_l4.0-w4.0-p0.50-bl-ep2.7]  11.22 22.97 270 top
NOREF  -  [Pad_e51]  4.1 6.34 0 top
NOREF#2  -  [Pad_e4827]  31.74 39.03 90 top
NOREF#3  -  [Pad_e772]  28.76 1.65 90 top
NOREF#4  -  [Pad_e788]  28.76 39.62 90 top
NOREF#5  -  [Pad_e782]  7.24 39.62 90 top
NOREF#6  -  [Pad_e763]  7.24 1.65 90 top
NOREF#7  -  [Pad_e52]  31.9 6.46 0 top
NOREF#8  -  [Pad_e6275]  4.26 39.03 90 top
Q1  SS8050  [SOT-23-3_L2.9-W1.3-P1.90-LS2.4-BR]  32.51 31.62 180 top
Q2  AO3401A  [sot-23_l2.9-w1.3-p1.90-ls2.4-br]  5.97 9.91 270 top
R1  3K  [R0603]  1.27 7.11 270 top
R24  43kΩ  [R0603]  28.37 34.77 90 top
R25  5.1kΩ  [R0603]  27.02 34.78 90 top
R35  10Ω  [R0603]  35.35 21.67 270 bottom
R39  4.7Ω  [R0402]  7.11 11.56 90 top
R40  10kΩ  [R0402]  6.86 7.24 90 top
R41  5.1kΩ  [R0402]  7.11 13.84 270 top
R42  5.1kΩ  [R0402]  7.11 19.3 90 top
R43  10kΩ  [R0402]  15.49 29.97 90 top
R44  10kΩ  [R0402]  27.44 31.38 270 top
R45  10kΩ  [R0402]  33.81 33.06 270 top
R46  3kΩ  [R0402]  30.01 32.63 0 top
R47  4.7kΩ  [R0402]  14.97 27.78 0 top
R48  4.7kΩ  [R0402]  14.49 29.97 90 top
R49  4.7kΩ  [R0402]  21.87 24.77 180 top
R50  33kΩ  [R0402]  28.11 29.92 0 top
R51  33kΩ  [R0402]  28.57 31.37 270 top
R52  4.7kΩ  [R0402]  4.82 25.14 180 top
R53  4.7kΩ  [R0402]  4.84 23.14 180 top
R54  10kΩ  [R0402]  26.42 21.72 90 top
RES  -  [test-point-0.5mm]  20.59 36.28 0 top
STM32  STM32F103C8T6  [LQFP-48_L7.0-W7.0-P0.50-LS9.0-BL]  21.08 30.23 0 top
SW1  K1-1502SA-02  [KEY-SMD_K1-1502SA-02]  31.62 14.48 270 top
TF  1040310811  [SIM-SMD_8P-1040310811]  21.46 13.84 0 top
U8  X1311FR-05-C43D24  [CONN-TH_5P-P1.27-H-F-W4.5-N]  35.18 33.27 90 top
USB1  TYPE-C 16PIN 2MD(073)  [USB-C-SMD_TYPE-C-6PIN-2MD-073]  3.68 16.64 270 top
VCC  -  [test-point-0.5mm]  14.66 36.24 0 top
W25Q128  W25Q128JVSIQ  [soic-8_l5.3-w5.3-p1.27-ls8.0-bl]  33.27 25.4 0 top
X1  8MHz  [CRYSTAL-SMD_4P-L3.2-W2.5-BL]  22.35 21.34 180 top
X2  32.768kHz  [OSC-SMD_L3.2-W1.5]  17.91 22.1 180 top
YX6200  YX6200  [sop-16_l9.9-w3.9-p1.27-ls6.0-bl]  11.18 9.65 90 top

## Footprints (pads in the part's own frame, mm; a bottom-side part is the same pattern mirrored in y, then rotated)
audio-smd_pj-342c
  rect 1.8x1.7 smd: 1(-4.4,4.38) 2(4.4,4.37) 3(-4.4,1.62) 4(4.4,-2.18)
  rect 1.4x1 smd: 5(-4.4,-3.38)
  rect 1.8x1 smd: 6(4.4,-4.38)
C0402
  rect 0.79x0.54 smd: 1(-0.545,0) 2(0.545,0)
C0603
  rect 0.8x0.9 smd: 1(-0.7,0) 2(0.7,0)
CASE-A_3216
  rect 1.5x1.359 smd: 1(-1.2,0) 2(1.2,0)
CONN-TH_5P-P1.27-H-F-W4.5-N
  rect 1x1 hole 0.7: 1(-2.54,0)
  round 1 hole 0.7: 2(-1.27,0) 3(0,0) 4(1.27,0) 5(2.54,0)
CRYSTAL-SMD_4P-L3.2-W2.5-BL
  rect 1.4x1.2 smd: 1(-1.1,-0.85) 2(1.1,-0.85) 3(1.1,0.85) 4(-1.1,0.85)
KEY-SMD_K1-1502SA-02
  rect 1.9x1.8 smd: 1(-2.5,-2.4) 2(2.5,-2.4) T(0,-2.4)
  rect 1.6x1.6 smd: 3(-5.4,2.4) C(5.4,2.4)
LED0402-R-RD
  rect 0.75x0.6 smd: 1(0.623,0) 2(-0.623,0)
led-smd_3p-l5.7-w3.0-rd
  rect 1.4x1.778 smd: 1(-2.82,0) 2(2.82,0)
  rect 2.286x1.7 smd: 3(0.3,0)
LQFP-48_L7.0-W7.0-P0.50-LS9.0-BL
  oval 0.27x1.5 smd: 1(-2.75,-4.25) 2(-2.25,-4.25) 3(-1.75,-4.25) 4(-1.25,-4.25) 5(-0.75,-4.25) 6(-0.25,-4.25) 7(0.25,-4.25) 8(0.75,-4.25) 9(1.25,-4.25) 10(1.75,-4.25) 11(2.25,-4.25) 12(2.75,-4.25) 25(2.75,4.25) 26(2.25,4.25) 27(1.75,4.25) 28(1.25,4.25) 29(0.75,4.25) 30(0.25,4.25) 31(-0.25,4.25) 32(-0.75,4.25) 33(-1.25,4.25) 34(-1.75,4.25) 35(-2.25,4.25) 36(-2.75,4.25)
  oval 1.5x0.27 smd: 13(4.25,-2.75) 14(4.25,-2.25) 15(4.25,-1.75) 16(4.25,-1.25) 17(4.25,-0.75) 18(4.25,-0.25) 19(4.25,0.25) 20(4.25,0.75) 21(4.25,1.25) 22(4.25,1.75) 23(4.25,2.25) 24(4.25,2.75) 37(-4.25,2.75) 38(-4.25,2.25) 39(-4.25,1.75) 40(-4.25,1.25) 41(-4.25,0.75) 42(-4.25,0.25) 43(-4.25,-0.25) 44(-4.25,-0.75) 45(-4.25,-1.25) 46(-4.25,-1.75) 47(-4.25,-2.25) 48(-4.25,-2.75)
OSC-SMD_L3.2-W1.5
  rect 1.05x1.7 smd: 1(-1.275,0) 2(1.275,0)
Pad_e51
  round 3.5 hole 2.3: 49(0,0)
Pad_e52
  round 3.5 hole 2.3: 50(0,0)
Pad_e763
  rect 3x2.5 hole 2.4x1.9: 49(0,0)
Pad_e772
  rect 3x2.5 hole 2.4x1.9: 49(0,0)
Pad_e782
  rect 3x2.5 hole 2.4x1.9: 50(0,0)
Pad_e788
  rect 3x2.5 hole 2.4x1.9: 50(0,0)
Pad_e4827
  round 1.7 hole 0.95: 15(0,0)
Pad_e6275
  round 1.7 hole 0.95: 15(0,0)
qfn-24_l4.0-w4.0-p0.50-bl-ep2.7
  oval 0.28x1.016 smd: 1(-1.25,-2.2) 2(-0.75,-2.2) 3(-0.25,-2.2) 4(0.25,-2.2) 5(0.75,-2.2) 6(1.25,-2.2) 13(1.25,2.2) 14(0.75,2.2) 15(0.25,2.2) 16(-0.25,2.2) 17(-0.75,2.2) 18(-1.242,2.2)
  oval 1.016x0.28 smd: 7(2.2,-1.25) 8(2.2,-0.75) 9(2.2,-0.25) 10(2.2,0.25) 11(2.2,0.75) 12(2.2,1.25) 19(-2.2,1.25) 20(-2.2,0.75) 21(-2.2,0.25) 22(-2.2,-0.25) 23(-2.2,-0.75) 24(-2.2,-1.25)
  rect 2.7x2.7 smd: 25(0.013,0)
R0402
  rect 0.566x0.54 smd: 1(-0.433,0) 2(0.433,0)
R0603
  rect 0.806x0.864 smd: 1(-0.753,0) 2(0.753,0)
SENSOR-SMD-6_AHT20
  rect 1x0.6 smd: 1(-1.2,1) 2(-1.2,0) 3(-1.2,-1) 4(1.2,-1) 5(1.2,0) 6(1.2,1)
SIM-SMD_8P-1040310811
  rect 0.7x1.2 smd: 1(3.138,-5.338) 2(2.038,-5.338) 3(0.938,-5.338) 4(-0.163,-5.338) 5(-1.262,-5.338) 6(-2.362,-5.338) 7(-3.462,-5.338) 8(-4.562,-5.338)
  rect 1.17x1.8 smd: 9(-5.772,-5.138)
  rect 1.55x1.35 smd: 10(5.598,-5.312)
  rect 1.2x1 smd: 11(5.772,0.662) 12(5.772,4.362)
  rect 1.9x1.35 smd: 13(2.272,5.338) 14(-3.697,5.338)
soic-8_l5.3-w5.3-p1.27-ls8.0-bl
  oval 0.63x1.778 smd: 1(-1.905,-3.53) 2(-0.635,-3.53) 3(0.635,-3.53) 4(1.905,-3.53) 5(1.905,3.53) 6(0.635,3.53) 7(-0.635,3.53) 8(-1.905,3.53)
sop-16_l9.9-w3.9-p1.27-ls6.0-bl
  oval 0.574x1.651 smd: 1(-4.445,-2.769) 2(-3.175,-2.769) 3(-1.905,-2.769) 4(-0.635,-2.769) 5(0.635,-2.769) 6(1.905,-2.769) 7(3.175,-2.769) 8(4.445,-2.769) 9(4.445,2.769) 10(3.175,2.769) 11(1.905,2.769) 12(0.635,2.769) 13(-0.635,2.769) 14(-1.905,2.769) 15(-3.175,2.769) 16(-4.445,2.769)
SOT-23-3_L2.9-W1.3-P1.90-LS2.4-BR
  rect 1.25x0.7 smd: 1(1,-0.95) 2(1,0.95) 3(-1,0)
SOT-23-3_L2.9-W1.6-P1.90-LS2.8-BR
  rect 1.07x0.6 smd: 1(1.235,-0.95) 2(1.235,0.95) 3(-1.235,0)
SOT-23-6_L2.9-W1.6-P0.95-LS2.8-BR
  rect 1.1x0.6 smd: 1(1.35,-0.95) 2(1.35,0) 3(1.35,0.95) 4(-1.35,0.95) 5(-1.35,0) 6(-1.35,-0.95)
sot-23_l2.9-w1.3-p1.90-ls2.4-br
  rect 0.7x0.8 smd: 1(1.15,-0.95) 2(1.15,0.95)
  rect 0.7x1 smd: 3(-1.15,0)
test-point-0.5mm
  rect 1x1.5 smd: 1(0,0)
test-point-0.5mm#2
  rect 1.778x1.524 smd: 1(0,0)
Test-Point-0.5mm
  round 0.5 smd: 1(0,0)
USB-C-SMD_TYPE-C-6PIN-2MD-073
  rect 0.55x1.1 smd: 1(-3.2,2.375) 2(-2.4,2.375) 11(2.4,2.375) 12(3.2,2.375)
  rect 0.3x1.1 smd: 3(-1.75,2.375) 4(-1.25,2.375) 5(-0.75,2.375) 6(-0.25,2.375) 7(0.25,2.375) 8(0.75,2.375) 9(1.25,2.375) 10(1.75,2.375)
  oval 1.1x2 hole 0.6x1.5: 13(-4.325,1.825) 14(4.325,1.825)
  oval 1.2x1.8 hole 0.6x1.2: 13(-4.325,-2.375) 14(4.325,-2.375)

## Nets
As in the schematic, except:
GND: 4057.2 AHT20.5 BAT-1.1 C2.1 C3.2 C56.1 C57.1 C60.2 C61.2 C62.1 C63.2 C64.2 C65.1 C66.1 C67.2 C68.1 C69.2 C70.2 C72.1 C73.1 C74.1 C75.1 CN1.1 GND.1 LDO1.1 MPU-6050.1 MPU-6050.9 MPU-6050.11 MPU-6050.18 MPU-6050.25 NOREF#3.49 NOREF#4.50 NOREF#5.50 NOREF#6.49 NOREF#8.15 Q1.2 R1.2 R25.2 R41.2 R42.2 R43.2 R44.1 R45.1 R54.2 STM32.8 STM32.23 STM32.35 STM32.47 TF.6 TF.9 TF.10 TF.11 TF.12 TF.13 TF.14 U8.1 USB1.1 USB1.12 USB1.13 USB1.14 W25Q128.4 X1.2 X1.4 YX6200.8 YX6200.13
ADCSBQ: NOREF#2.15 R24.2

Pads without a net: AHT20 1 6; CN1 2 5 6; MPU-6050 2 3 4 5 6 7 14 15 16 17 19 21 22; NOREF 49; NOREF#7 50; SW1 3; TF 1 2 8; USB1 3 9; YX6200 4 16

## Via types
v1: diameter 0.55, hole 0.305, Top Layer to Bottom Layer, 102 vias
v2: diameter 0.61, hole 0.305, Top Layer to Bottom Layer, 17 vias

## Routing (per net, layer and track width the routed paths; a pad name or vN(x,y) marks a point on that pad's centre or on a via; arc(x,y) is an arc through that point)
5V: length 12.7
  Top Layer w0.254: 4.83,18.29 5.33,18.8 USB1.2 ; v2(4.44,14.99) 5.74,14.21 5.86,14.17 6.06,14.26
  Top Layer w0.584: 4.32,14.86 2.79,13.33 2.79,11.81 1.97,10.98 1.06,10.98 ; 4.83,18.29 4.24,17.7 4.24,15.19 v2(4.44,14.99)
GND: length 85.1
  Top Layer w0.254: 18.04,28.26 17.73,27.96 17.29,27.96 ; 11.97,20.78 11.97,22.01 11.98,22.02 ; 7.73,16.91 7.68,16.86 7.68,15.56 ; 12.24,24.03 12.41,24.19 13.43,24.19 ; 21.84,26.21 21.84,27.25 21.27,27.82 20.79,27.82 ; 10.96,20.79 10.96,21.96 11.02,22.01 ; 10.16,23.94 9.88,24.22 9.03,24.22 ; 10.98,19.5 10.98,20.73 10.97,20.74 ; 19.32,33.26 18.83,33.75 18.83,34.49 ; 25.35,32.47 24.19,32.47 23.55,31.83
  Top Layer w0.381: 30.89,30.32 30.92,30.32 ; 30.92,30.32 30.89,30.35 30.89,31.02 30.89,31.02 32.13,31.02 32.14,31.01 32.14,30.33 32.13,30.32 30.92,30.32 ; 30.92,30.32 30.92,30.32 ; 2.02,25.41 2.02,26.51 ; 2.02,26.51 3.56,26.51 3.85,26.22 ; 2.02,26.51 2.02,26.73 2.33,27.04
  Top Layer w0.5: 5.87,0.64 5.87,3.2 5.97,3.3 8,3.3 ; 28,3.3 30.1,3.3 30.1,0.63
  Top Layer w0.508: 5.97,40.53 5.97,38.14 5.99,38.12 8,38.12 8,38.13 ; 28.15,38.08 30.05,38.08 30.11,38.15 30.11,40.46 ; USB1.12 7.09,13.44 R41.2 ; 18.41,20.4 18.41,19.35 18.35,19.29 ; 17.59,19.34 17.3,19.63 17.3,20.41 ; 16.98,18.51 17.2,18.28 18.63,18.28 ; 7.11,19.74 7.01,19.84 USB1.1
  Top Layer w0.635: 21.69,23.58 21.69,22.42 21.66,22.39 ; 6.3,20.09 6.61,20.4 6.61,21.17 ; 4.34,24.14 4.33,24.13 v1(3.76,24.13) ; 5.9,13.34 5.9,12.46 5.74,12.3 ; 22.84,19.91 24.12,19.91 24.15,19.93 ; 6.6,20.11 7.25,20.11 7.3,20.17
  Top Layer w0.762: 12.98,15.62 13.99,16.62 14.26,16.62 ; v2(3.05,10.03) 4057.2
  Top Layer w1.016: 8.17,9.01 8.9,9.01 ; 13.92,14.07 13.33,14.07 12.59,14.81
  Top Layer w1.27: 12.24,15.28 12.87,15.28 12.88,15.27 ; 14.46,16.69 14.46,17.89 14.44,17.91
  Bottom Layer w0.508: 5.87,0.63 5.85,0.66 5.85,3.23 5.91,3.3 8.01,3.3 ; 5.92,40.37 5.92,38.05 5.99,37.98 7.99,37.98 ; 28.06,3.4 29.97,3.4 30.08,3.29 30.08,0.67 30.09,0.66 ; 27.56,38.07 30.13,38.07 30.24,38.18 30.24,40.56
  Bottom Layer w0.635: 6.32,4.59 8.18,4.59 8.33,4.74 8.33,6.15 6.54,6.15 6.49,6.1 6.49,4.76 6.32,4.59
  vias: v1(2.43,10.09) v1(2.44,9.45) v1(2.44,8.8) v1(10.53,22.46) v1(10.56,22.91) v1(11.04,23.39) v1(11.04,22.94) v1(11.02,22.46) v1(11.52,23.41) v1(11.51,22.94) v1(11.5,22.45) v1(12,23.43) v1(11.98,22.94) v1(11.97,22.45) v1(13.48,36.42) v1(15.15,31.23) v1(15.54,34.67) v1(16.9,25.54) v1(17.44,15.7) v1(17.95,22.03) v1(19.66,33.17) v1(19.78,30.31) v1(20.19,18.45) v1(20.36,27.45) v1(22.9,30.62) v1(27.61,32.2) v1(30.32,31.38) v1(30.32,30.93) v1(30.77,31.4) v1(31.24,31.43) v1(31.37,25.41) v1(31.53,35.81) v1(32,24.69)
(no net):
  vias: v1(32.72,35.79)
ADC1: length 6.9
  Top Layer w0.254: 27.15,33.74 26.81,33.4 v1(26.7,33.4) ; 24.96,30.48 24.95,30.47 v1(24.33,30.47)
  Top Layer w0.635: 27.03,34.02 28.17,34.02
  Inner2 w0.381: v1(24.33,30.47) 25.41,30.47 26.72,31.78 26.72,33.38 v1(26.7,33.4)
ADCSBQ: length 5.5
  Top Layer w0.254: 28.41,35.58 28.61,35.78 30.28,35.78 31.69,37.19 31.69,38.75
AHT-SCL: length 21.1
  Top Layer w0.254: 16.86,31.98 16.85,31.98 v1(15.16,31.98)
  Top Layer w0.381: 4.39,23.14 3.15,23.14 3.14,23.13
  Top Layer w0.635: 3.05,23.15 3.06,23.15 v1(3.06,23.69)
  Inner1 w0.381: v1(3.06,23.69) 3.4,23.35 5.05,23.35 5.4,23.69 5.4,23.69 9.42,23.69 13.7,27.97 13.7,31 14.68,31.98 v1(15.16,31.98)
AHT-SDA: length 21.3
  Top Layer w0.254: v1(15.18,32.72) 15.53,32.72 15.79,32.47 16.77,32.47
  Top Layer w0.381: 3.12,25.14 3.14,25.12 4.38,25.12
  Top Layer w0.635: 3.06,25.44 3.08,25.42 v1(3.08,24.64)
  Inner1 w0.381: 9.31,24.64 12.95,28.28 12.95,31.37 14.32,32.74 15.16,32.74 v1(15.18,32.72) ; v1(3.08,24.64) 3.39,24.95 5.07,24.95 5.38,24.64 9.32,24.64
BAT+: length 100.6
  Top Layer w0.254: R40.2 6.86,8.69 6.92,8.76
  Top Layer w0.508: LDO1.3 9.78,16.26 9.53,16.51 9.53,16.89 C2.2
  Top Layer w0.635: 3.93,10.98 4.51,10.98 v2(4.95,10.54) ; v2(4.95,10.54) v2(4.95,10.07) ; v2(4.95,10.54) v2(4.95,10.07) ; v2(4.95,10.07) v2(5.51,10.07) ; v2(4.95,10.07) 5.24,9.78 ; v2(5.51,10.07) 5.6,10.07 6.92,8.76 ; v2(5.51,10.07) 5.24,9.81 5.24,9.78 ; v2(10.55,14.72) v2(10.55,15.24) 10.55,15.9 LDO1.3 ; v1(29.01,29.92) 28.63,29.92 28.63,29.92 ; 5.24,9.78 v2(5.24,9.7)
  Top Layer w0.762: v1(28.26,7.02) 28.93,7.02 28.94,7.03
  Bottom Layer w0.381: v1(29.01,29.92) 31.32,29.92 33.86,27.37 33.86,21.68 34.66,20.89
  Bottom Layer w0.635: 5.51,10.54 v2(5.51,10.07) 5.51,9.97 v2(5.24,9.7) 4.95,10 v2(4.95,10.54) 5.51,10.54 ; 5.51,10.54 7.62,10.54 10.55,13.47 v2(10.55,14.72) v2(10.55,15.24) v2(10.55,15.76) 10.55,19.69 12.89,22.02 12.89,26.65 14.06,27.82 14.06,34.9 v1(14.64,35.48) ; 5.51,10.54 5.51,10.55
  Bottom Layer w1.143: 7.4,8.86 6.22,10.03 7.37,10.03 7.49,10.16 7.49,9.27
  Bottom Layer w1.524: 34.79,20.54 34.8,20.54 34.8,15.49 34.04,14.73 32.77,14.73 30.86,12.83 30.86,10.16 26.07,5.37 BAT+1.1 9.94,6.83 7.49,9.27
BATFY: length 3.6
  Top Layer w0.254: 25.36,29.96 27.68,29.96 27.7,29.97 27.7,30.08 28.49,30.87 28.49,30.92
BATFYPW: length 6
  Top Layer w0.254: 28.79,31.96 29,31.75 v1(29,31.67) ; 25.26,31.47 24.36,31.47 v1(24.35,31.48)
  Bottom Layer w0.254: v1(24.35,31.48) 28.81,31.48 v1(29,31.67)
CHRG: length 36.6
  Top Layer w0.254: 16.86,30.98 18.65,30.98 v1(18.67,30.95)
  Inner1 w0.254: v1(3.33,9.06) 3.69,9.42 3.69,11.24 3.13,11.8 3.13,20.92 4.05,21.84 12.29,21.84 14.88,24.43 14.88,29.24 16.59,30.95 v1(18.67,30.95)
D+: length 21.3
  Top Layer w0.254: v1(5.11,15.87) 5.12,15.86 5.77,15.86 ; 6.06,16.91 6.76,16.91 6.93,16.75 6.93,16.01 6.82,15.91 6.06,15.91
  Top Layer w0.381: 13.94,11.55 12.04,11.55 v1(11.11,12.48)
  Inner1 w0.381: v1(11.11,12.48) 11.38,12.75 11.38,16.49 9.82,18.05 4.49,18.05 3.98,17.54 3.98,16.4 4.52,15.87 v1(5.11,15.87)
D-: length 15.5
  Top Layer w0.254: 6.06,17.41 5.43,17.41 5.21,17.19 5.21,16.59 5.38,16.41 6.06,16.41
  Top Layer w0.381: 13.9,10.24 12.09,10.24 v1(10.5,11.83)
  Inner1 w0.381: v1(10.5,11.83) 9.39,12.94 9.39,15.13 7.3,17.23 v1(5.09,17.23)
KEY1: length 19
  Top Layer w0.254: 18.84,26.24 18.84,26.86 19.14,27.15 19.51,27.15 v1(19.6,27.24)
  Inner1 w0.254: v1(19.6,27.24) 19.6,27.6 20.22,28.22 21.26,28.22 24.37,25.11 24.37,21.38 28,17.76 v1(29.95,17.76)
KEY2: length 19.6
  Top Layer w0.254: v1(22.88,27.8) 22.83,27.75 22.83,26
  Inner2 w0.254: v1(28.5,12.76) 28.5,15.81 23.42,20.89 23.42,23.04 22.32,24.14 22.32,27.24 v1(22.88,27.8)
KEY3: length 17.9
  Top Layer w0.254: v1(23.75,27.89) 23.75,27.71 23.32,27.29 23.32,25.99
  Inner2 w0.254: v1(23.75,27.89) 23.75,27.75 23.01,27.02 23.01,25.8 23.93,24.89 23.93,21.18 v1(29.89,15.22)
LEDPW: length 4.6
  Top Layer w0.254: 25.34,31.97 26.27,31.97 27.05,32.75 29.27,32.75 29.44,32.58 29.59,32.58
MPU6050-SCL: length 8.9
  Top Layer w0.254: 14.54,28.25 14.69,28.39 14.69,28.45 ; 14.53,27.78 14.53,28.37 14.45,28.45 ; 16.44,28.47 13.83,28.47 11.35,25.99 10.62,25.99 10.47,25.84 10.47,24.92
MPU6050-SDA: length 10
  Top Layer w0.254: 14.51,29.15 14.68,28.98 ; 14.52,29.5 14.52,29.16 14.4,29.04 ; 16.92,28.98 13.64,28.98 11.12,26.46 10.4,26.46 9.96,26.03 9.96,24.92
MPU6050INT: length 13.8
  Top Layer w0.254: 16.82,29.96 17.79,29.96 18.21,29.54 18.21,29.33 v1(18.24,29.29) ; 12.52,21.06 12.63,20.94 12.63,20.69 v1(12.79,20.53)
  Inner2 w0.254: v1(18.24,29.29) 17.98,29.03 17.46,29.03 12.79,24.36 v1(12.79,20.53)
OLED-CS: length 2.3
  Top Layer w0.254: 23.84,34.48 23.84,35.15 24.31,35.62 25.28,35.62
OLED-D0: length 6.8
  Top Layer w0.254: 21.84,34.66 21.83,34.67 21.83,35.26 22.01,35.44 v1(22.01,35.65)
  Inner1 w0.305: 16.67,36.67 20.82,36.67 21.85,35.65 v1(22.01,35.65)
  vias: v1(16.66,36.67)
OLED-D1: length 6.5
  Top Layer w0.254: 22.33,34.26 22.33,33.37 v1(22.32,33.36)
  Inner1 w0.305: v1(22.32,33.36) 22.32,33.82 21.76,34.38 19.1,34.38 18.33,35.15 18.33,35.72 v1(18.34,35.73)
OLED-DC: length 1.6
  Top Layer w0.254: 23.32,34.48 23.32,36.04 23.33,36.05
OLED-RES: length 4.5
  Top Layer w0.254: v1(23.07,33.32) 23.07,33.39 22.84,33.62 22.84,34.05 22.83,34.06
  Inner1 w0.305: v1(20.86,35.73) 20.86,35.67 21.61,34.92 22.13,34.92 23.07,33.97 v1(23.07,33.32)
STDBY: length 33.7
  Top Layer w0.254: v1(18.13,31.55) 18.06,31.47 16.84,31.47
  Inner1 w0.254: 1.52,10.03 2.66,11.17 2.66,21.08 4.21,22.63 9.42,22.63 14.34,27.55 14.34,29.41 16.48,31.55 v1(18.13,31.55)
  vias: v1(1.52,10.04)
STM32-RESET: length 7.9
  Top Layer w0.254: 21.33,25.98 21.33,24.8 21.4,24.73 ; 24.18,24.82 24.18,24.85 24.68,25.36 25.07,25.36 ; v1(21.14,27.15) 21.33,26.95 21.33,26.54
  Top Layer w0.508: v1(23.1,24.65) 23.82,24.65
  Inner1 w0.254: v1(23.1,24.65) 23.08,24.67 21.71,24.67 21.14,25.25 v1(21.14,27.15)
STM323V3: length 102.7
  Top Layer w0.254: 16.8,27.27 16.95,27.42 16.95,27.43 ; 18.2,34.27 18.21,33.98 ; 20.39,29.33 22.33,27.39 22.33,26.39 ; 18.26,34.1 16.98,34.1 16.51,33.62 15.02,33.62 14.49,33.09 14.49,30.36 ; 20.86,29.97 20.86,30.07 19.94,30.99 19.56,30.99 18.33,32.21 STM32.36 ; 13.68,21.71 14.55,21.71 ; 18.32,25.98 18.33,25.98 18.33,24.3 ; 10.48,20.35 10.1,19.65 ; 21.28,32.5 23.46,32.5 23.93,32.97 24.97,32.97 ; 15.25,27.5 15.27,27.48 16.82,27.48 ; 16.69,27.39 16.79,27.29 16.79,26.46 ; 17.14,27.47 18.09,27.47 18.33,27.23 18.33,26.05 18.32,26.04 ; 22.33,25.97 22.33,24.91 22.27,24.85
  Top Layer w0.381: 5.26,23.14 5.29,23.17 ; 5.26,23.14 5.25,23.15 5.25,25.15 ; 5.26,23.14 5.26,22.6 4.66,22 2.54,22 2.05,22.49 2.05,22.96 ; 9.53,19.61 9.53,20.02 8.76,20.79 8.01,20.79 6.02,22.77 5.37,22.77 ; v1(33.34,18.4) 34.46,17.28 34.46,9.59 ; 21.29,30.39 21.29,32.43
  Top Layer w0.508: 12.61,17.87 10.85,17.87 9.73,18.99 9.73,19.56 ; 21.29,30.39 v1(18.4,27.51) ; v1(33.06,23.44) 33.92,22.58 33.92,21.56
  Top Layer w0.635: 31.37,28.94 31.44,28.87 32.56,28.87 ; 31.16,28.65 31.15,28.64 30.49,28.64
  Top Layer w0.762: 14.05,20.02 13.8,20.02 13.13,19.35 13.13,18.16 ; v1(29.13,28.73) 29.22,28.64 30.37,28.64
  Top Layer w1.27: 12.67,18.13 12.66,18.12 12.66,17.19
  Bottom Layer w0.381: v1(33.06,23.44) 33.06,18.7 33.33,18.43
  Bottom Layer w0.508: 33.07,23.43 33.07,25.24 v1(29.57,28.74)
  Bottom Layer w0.762: 29.51,28.73 v1(29.13,28.73) 19.58,28.73 18.45,27.61 18.45,24.92 v1(15,21.46) ; v1(14.11,21.45) 14.98,21.45
  vias: v1(14.56,21.45)
STMRX: length 16.2
  Top Layer w0.254: 20.84,34.44 20.84,33.53 v1(20.97,33.4)
  Bottom Layer w0.381: v1(20.97,33.4) 22.61,35.05 33.95,35.05 34.49,34.52 35.19,34.52
STMTX: length 15.3
  Top Layer w0.254: v1(21.89,36.5) 21.87,36.5 21.45,36.08 21.45,35.36 21.33,35.24 21.33,34.98
  Bottom Layer w0.381: 35.21,35.84 34.55,36.5 v1(21.89,36.5)
SWCLK: length 19.8
  Top Layer w0.254: v1(17.24,33.26) 17.02,33.26 16.75,32.99
  Inner2 w0.381: 35.21,32 34.5,32 32.37,34.13 18.11,34.13 v1(17.24,33.26)
SWDIO: length 17.7
  Top Layer w0.254: v1(19.34,35.55) 19.33,35.54 19.33,34.65
  Inner2 w0.381: v1(19.34,35.55) 20.02,34.86 32.92,34.86 34.52,33.26 35.21,33.26
W25_CLK: length 9.6
  Top Layer w0.254: 25.83,28.47 26.37,28.47 v1(28.31,26.53) ; 33.89,28.4 32.9,27.41 v1(32.56,27.41)
  Inner1 w0.381: v1(28.31,26.53) 31.68,26.53 v1(32.56,27.41)
W25_CS: length 8.4
  Top Layer w0.254: 31.31,22.5 27.48,26.33 27.48,26.69 26.2,27.98 25.36,27.98
W25_DI: length 11.8
  Top Layer w0.254: 35.1,28.48 35.1,28.09 33.81,26.81 29.81,26.81 27.15,29.48 25.33,29.48
W25_DO: length 10.7
  Top Layer w0.254: 32.62,22.15 32.62,22.33 29.06,25.9 29.06,26.71 26.8,28.97 25.37,28.97
YX_PWR: length 33.1
  Top Layer w0.254: v1(18.84,29.94) 18.31,30.47 16.86,30.47 ; v2(5.59,8.76) 5.59,8.23 6.22,7.6 6.22,7.24 6.48,6.98 6.68,6.98 R40.1
  Top Layer w0.635: Q2.1 5.58,8.76 v2(5.59,8.76)
  Inner2 w0.508: v1(18.84,29.94) 19.1,29.68 19.1,28.56 18.82,28.28 17.85,28.28 13.39,23.81 13.39,20.98 13.55,20.82 13.55,16.54 5.78,8.76 v2(5.59,8.76)
YXRX: length 28
  Top Layer w0.254: 23.87,25.74 23.88,25.74 24.05,25.91 24.05,26.41 v1(24.13,26.49)
  Top Layer w0.381: v1(10.87,7.91) 9.46,6.51 8.36,6.51
  Bottom Layer w0.381: v1(24.13,26.49) 24.13,21.18 v1(10.87,7.91)
YXTX: length 28.5
  Top Layer w0.254: 25.54,27.4 25.4,27.26 24.83,27.26 v1(24.76,27.19)
  Top Layer w0.381: 10.3,8.65 9.37,7.72 8.42,7.72
  Bottom Layer w0.381: v1(24.76,27.19) 23.27,27.19 22.26,26.18 22.26,22.02 10.29,10.05 v1(10.29,8.67)
YXV3.3: length 1.5
  Top Layer w0.508: 8.41,11.56 7.97,11.12 R39.1
$1N3494: length 1
  Top Layer w0.762: 1.27,8.88 R1.1
$1N4397: length 4.8
  Top Layer w0.762: 32.98,31.13 33.21,30.89 33.21,30.7 33.64,30.7 33.85,30.91 33.85,31.12
  Bottom Layer w1.524: 33.41,31.11 33.41,29.72 34.08,29.05 35.1,29.05
  vias: v1(32.98,31.13) v1(33.2,30.71) v1(33.41,31.13) v1(33.65,30.71) v1(33.86,31.13)
$1N4402: length 2.9
  Top Layer w0.381: 33.78,32.59 33.77,32.58 31.5,32.58
  Top Layer w0.508: 30.42,32.6 31.02,32.6
$1N5156: length 7.7
  Top Layer w0.254: STM32.3 19.33,23.78 18.92,23.37 17.53,23.37 16.63,22.47 X2.2
  Top Layer w0.381: X2.2 16.63,21.71 16.13,21.21 16.13,20.54 C63.1
$1N5157: length 6
  Top Layer w0.254: X2.1 19.56,22.47 19.56,23.24 19.83,23.51 STM32.4
  Top Layer w0.381: X2.1 19.43,21.85 19.43,20.7 19.59,20.54 C64.1
$1N5158: length 6.5
  Top Layer w0.254: X1.3 20.92,20.49 20.19,21.21 20.19,23.15 C66.2 20.33,23.95 STM32.5
$1N5159: length 5.7
  Top Layer w0.254: C65.2 22.95,23.66 22.44,24.17 21.04,24.17 20.83,24.38 STM32.6
  Top Layer w0.508: C65.2 22.95,22.69 X1.1
$1N5168: length 1.1
  Top Layer w0.254: 15.66,29.52 15.69,29.49 16.76,29.49
$1N5201: length 2.1
  Top Layer w0.254: 25.31,30.98 27.31,30.98 27.37,30.92
$1N5846: length 1.9
  Top Layer w0.254: 11.97,24.93 11.97,25.84 12.51,26.38 12.78,26.38
$1N5858: length 0.7
  Top Layer w0.254: 11.47,20.4 11.84,19.78
$1N10780: length 35
  Top Layer w0.635: v1(7.87,13.21) v1(8.35,13.21) ; v2(5.72,36.45) 5.72,36.39 ; v2(5.72,36.96) 6.22,36.45 6.29,36.45
  Bottom Layer w0.635: v2(5.72,36.45) v2(5.72,36.96)
  Bottom Layer w0.762: v2(5.72,36.96) 6.1,36.58 8.51,36.58 8.89,36.19 12.32,36.19 12.83,35.69 12.83,28.19 12.32,27.69 11.56,27.69 9.53,25.65 9.53,13.97 8.76,13.21 v1(8.35,13.21) v1(7.87,13.21)
$1N10809: length 14.8
  Top Layer w0.635: v1(7.87,14.48) v1(8.35,14.48) ; v2(9.02,27.3) 8.45,27.3 C59.1
  Bottom Layer w0.762: v1(7.87,14.48) v1(8.35,14.48) 8.36,26.13 v2(9.02,26.8) 9.02,27.3
$1N10843: length 1.6
  Top Layer w0.889: CN1.3 5.79,27.18 C59.2
$1N10898: length 4
  Top Layer w0.508: 14.48,15.17 14.8,15.17 15.37,14.6 15.37,13.33 14.86,12.83 YX6200.7
$1N10910: length 10.4
  Top Layer w0.508: v2(12.32,7.75) 12.32,5.71 12.83,5.21 YX6200.1
  Top Layer w0.635: v2(18,7.69) TF.7
  Bottom Layer w0.508: v2(18,7.69) 17.94,7.75 v2(12.32,7.75)
$1N10951: length 7.6
  Top Layer w0.305: YX6200.3 14.6,7.75 15.49,6.86 19.05,6.86 20.2,8.01 TF.5
$1N11148: length 24.1
  Top Layer w0.508: C61.1 21.75,9.94 21.3,9.49 TF.4 ; v2(7.11,12.45) R39.2
  Inner1 w0.508: 21.52,9.92 21.26,9.67 9.89,9.67 v2(7.11,12.45)
  vias: v1(21.25,9.64) v1(21.58,9.93)
$1N11256: length 10
  Top Layer w0.305: TF.3 22.4,7.67 21.97,7.24 20.45,7.24 19.43,6.22 15.24,6.22 14.99,6.48 YX6200.2
$1N11269: length 9.2
  Top Layer w0.508: 8.41,10.29 9.14,10.29 9.65,10.79 9.65,14.92 C62.2
  Top Layer w0.635: 8.41,10.29 6.73,10.29 5.97,11.05 Q2.3
$1N11541: length 1.7
  Top Layer w0.889: 7.69,36.45 9.12,36.45 CN1.4
$1N11648: length 1.5
  Top Layer w0.254: USB1.10 6.83,14.89 6.99,14.73 6.99,14.4 R41.1
$1N11687: length 1.8
  Top Layer w0.254: USB1.4 6.71,17.89 6.99,18.16 6.99,18.74 R42.1
$1N18711: length 15.5
  Top Layer w0.254: v1(20.32,32.64) 20.33,32.65 STM32.32
  Top Layer w0.508: LED2.1 25.29,22.35 v1(25.29,22.97)
  Inner2 w0.508: v1(25.29,22.97) 25.27,22.99 25.27,24 25.78,24.51 25.78,27.69 24.38,29.08 22.86,29.08 21.84,30.1 21.84,31.11 v1(20.32,32.64)
$1N18751: length 1.2
  Top Layer w0.508: LED2.2 26.23,21.09 R54.1

## Copper pours and planes (outline as drawn; the poured copper is in the pictures)
GND on Top Layer: -12.57,50.67 39.36,50.67 39.36,-4.41 -12.57,-4.41
GND on Bottom Layer: -10.44,47.73 36.31,47.73 36.31,-1.06 -10.44,-1.06
GND on Inner1: -11.96,49.65 37.73,49.65 37.73,-2.99 -11.96,-2.99
GND on Inner2: -11.15,48.74 37.43,48.74 37.43,-2.38 -11.15,-2.38

## Text on the board
Top Silkscreen Layer: MUSIC WH | ZHAO-Watch | 32G/max
